# EAGLE design UI_BOARD (EAGLE 9.6.1)
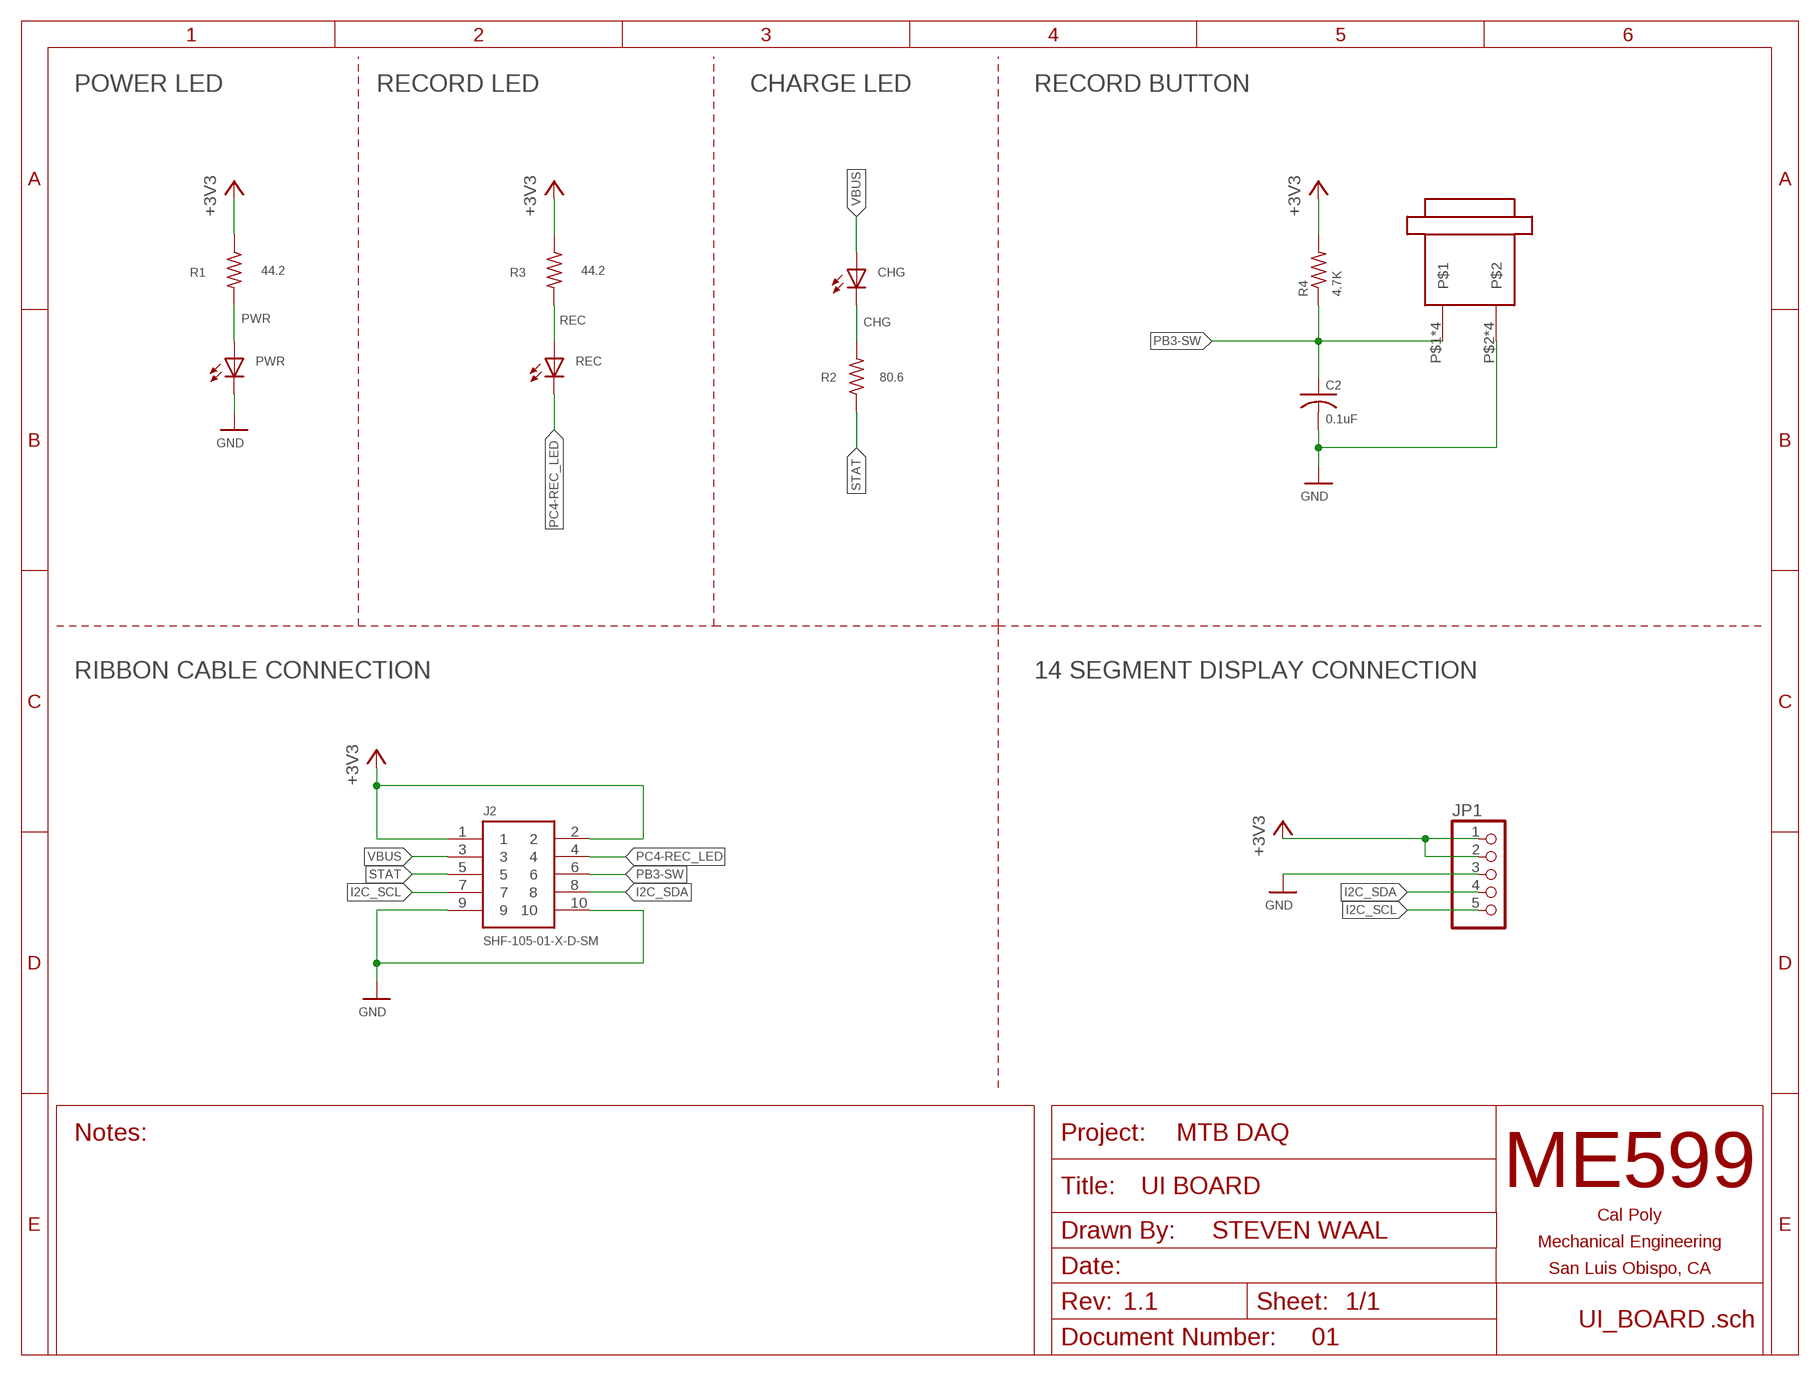
[diagram p0: schematic, sheet 1]
FRAME2 (TITLEBLOCK): AUTHOR: STEVEN WAAL; BOARD_NAME: UI BOARD; DOC_NUM: 01; PROJECT_NAME: MTB DAQ; REVISION: 1.1

## Parts
C2  0.1uF  C-USC0805  [C0805]
CHG  PANEL_MOUNT_LED  [PANEL_MOUNT_LED]
J2  SHF-105-01-X-D-SM  [SHF-105-01-X-D-SM]
JP1  PINHD-1X5  [1X05]
PWR  PANEL_MOUNT_LED  [PANEL_MOUNT_LED]
R1  44.2  R-US_R0805  [R0805]
R2  80.6  R-US_R0805  [R0805]
R3  44.2  R-US_R0805  [R0805]
R4  4.7K  R-US_R0805  [R0805]
REC  PANEL_MOUNT_LED  [PANEL_MOUNT_LED]
U$4  PANEL_MOUNT_PUSH_BUTTON  [PANEL_MOUNT_PUSH_BUTTON]

## Nets
+3V3: J2.1 J2.2 JP1.1 JP1.2 R1.1 R3.1 R4.2
CHG: CHG.P$2 R2.2
GND: C2.2 J2.9 J2.10 JP1.3 PWR.P$2 U$4.P$2 U$4.P$4 U$4.P$6 U$4.P$8
I2C_SCL: J2.7 JP1.5
I2C_SDA: J2.8 JP1.4
PB3-SW: C2.1 J2.6 R4.1 U$4.P$1 U$4.P$3 U$4.P$5 U$4.P$7
PC4-REC_LED: J2.4 REC.P$2
PWR: PWR.P$1 R1.2
REC: R3.2 REC.P$1
STAT: J2.5 R2.1
VBUS: CHG.P$1 J2.3

## Notes on the sheet
- POWER LED | RECORD LED | CHARGE LED | RECORD BUTTON
- RIBBON CABLE CONNECTION | 14 SEGMENT DISPLAY CONNECTION

## Library data of the parts
C2 = rcl:C-US: CAPACITOR, American symbol; SPICEPREFIX: C
CHG PWR REC = DigikeyLibrary:PANEL_MOUNT_LED: Digikey# 492-1573-ND
J2 = DigikeyLibrary:SHF-105-01-X-D-SM: 0.050"X0.050" SHROUDED TERMINAL STRIP ASSEMBLY, 10PINS.; AVAILABILITY: Unavailable; DESCRIPTION: Connector Header Surface Mount 10 position 0.050 _1.27mm_; MF: Samtec; MP: SHF-105-01-L-D-SM; PACKAGE: None; PRICE: None
JP1 = pinhead:PINHD-1X5: PIN HEADER
R1-R4 = rcl:R-US_: RESISTOR, American symbol; SPICEPREFIX: R
U$4 = DigikeyLibrary:PANEL_MOUNT_PUSH_BUTTON: Digikey# EG5385-ND

## Board
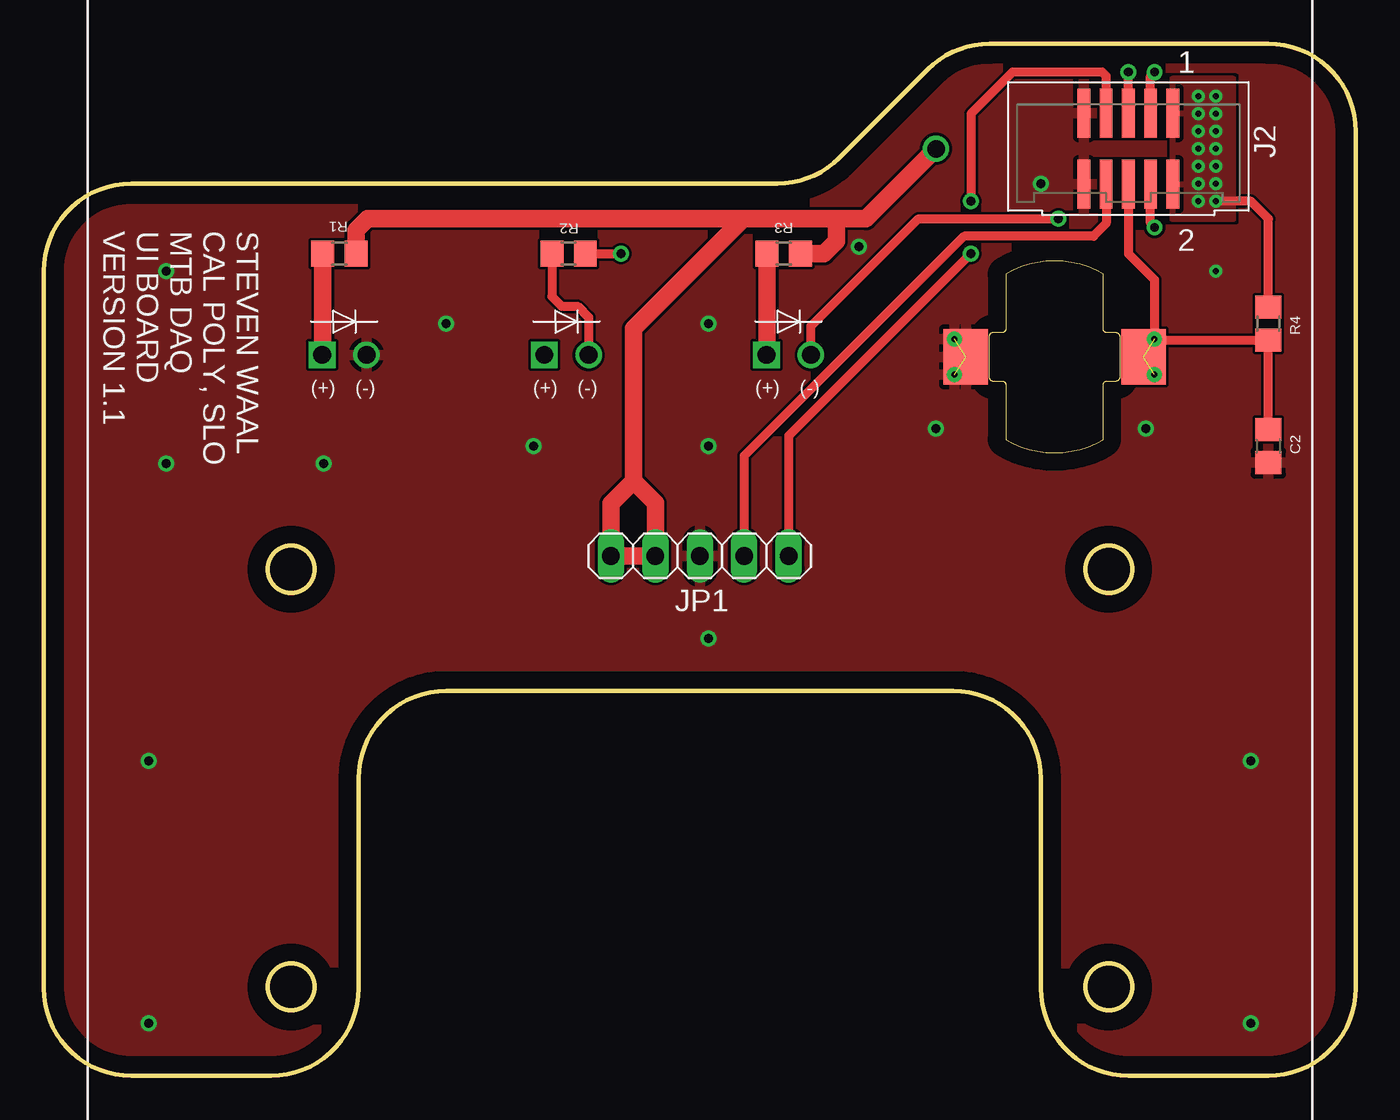
[diagram p1: board, top side]
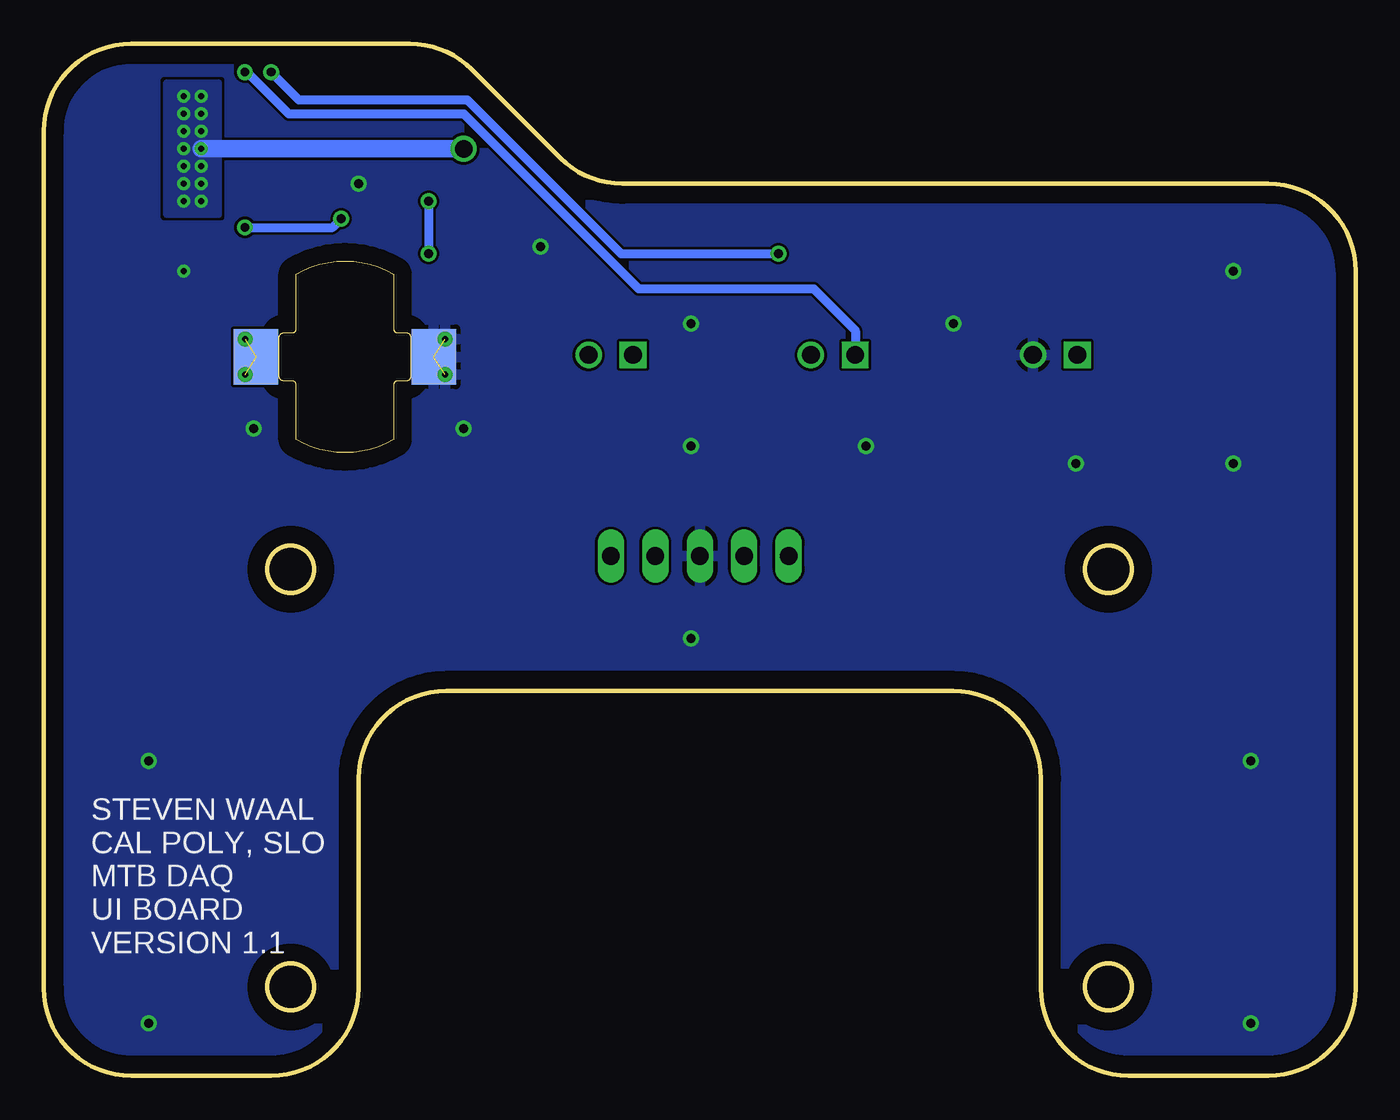
[diagram p2: board, bottom side, seen from below]

Size 75 x 59 mm. Coordinates in mm from the lower left corner, seen from the top.
Outline: 0,46 0,5 arc90 5,0 13,0 arc90 18,5 18,17 arc-90 23,22 52,22 arc-90 57,17 57,5 arc90 62,0 70,0 arc90 75,5 75,54 arc90 70,59 54.07,59 arc45 50.54,57.54 45.46,52.46 arc-45 41.93,51 5,51 arc90 0,46
Outline: circle at 14.14,5.08 radius 1.33
Outline: circle at 60.88,28.96 radius 1.33
Outline: circle at 60.88,5.08 radius 1.33
Outline: circle at 14.14,28.96 radius 1.33
Copper layers (1*16): Top 0.035mm / dielectric 1.5mm / Bottom 0.035mm
Design rules "default *": minimum track width 6mil, minimum drill 0.35mm, track to track 6mil, track to pad 6mil, pad to pad 6mil, via to via 6mil, smd to smd 6mil, copper to edge 40mil, drill to drill 6mil, minimum pad ring 10mil, minimum via ring 8mil, stop-mask expansion 4mil, vias tented up to drill 20mil, thermal gap 10mil

### Footprints (pad centres in the part's own frame; a part is rotated, then mirrored left to right if it is on the bottom)
C0805 = smd 1.3 x 1.5: 1 -0.95,0; 2 0.95,0
PANEL_MOUNT_LED = drill 1.016 square: P$1 0,0 | drill 1.016: P$2 2.54,0
SHF-105-01-X-D-SM = smd 0.737 x 2.794: 1 -2.54,-2.032; 2 -2.54,2.032; 3 -1.27,-2.032; 4 -1.27,2.032; 5 0,-2.032; 6 0,2.032; 7 1.27,-2.032; 8 1.27,2.032; 9 2.54,-2.032; 10 2.54,2.032
1X05 = drill 1.016 long: 1 -5.08,0; 2 -2.54,0; 3 0,0; 4 2.54,0; 5 5.08,0
R0805 = smd 1.3 x 1.5: 1 -0.95,0; 2 0.95,0
PANEL_MOUNT_PUSH_BUTTON = smd 2.54 x 3.175: P$1 -5.08,0; P$2 5.08,0 | smd 2.54 x 3.175 bottom: P$3 -5.08,0; P$4 5.08,0 | drill 0.35: P$5 -5.715,1.016; P$6 5.715,-1.016; P$7 -5.715,-1.016; P$8 5.715,1.016

### Placement (x,y rotation side)
C2  70,36 270 top
CHG  28.61,41.21 0 top
J2  62,53 180 top
JP1  37.5,29.72 0 top
PWR  15.91,41.21 0 top
R1  16.9,47 180 top
R2  30,47 180 top
R3  42.3,47 180 top
R4  70,43 90 top
REC  41.31,41.21 0 top
U$4  57.78,41.1 180 top

### Tracks (layer width: path | path; a pad name or v marks a point on that pad's centre or on a via)
+3V3  (via drill 0.35, 1)
  Top 0.5: R4.2 70,49 69,50 v67,50
  Top 1: R1.1 17.85,48.35 18.5,49 40,49 | 45.3,49 47,49 v51,53 | 45.3,49 40,49 | R3.1 44.6,47 45.3,47.7 45.3,49 | 33.7,34 33.7,42.7 40,49 | 33.7,34 32.42,32.72 JP1.1 JP1.2 34.96,32.74 33.7,34
  Bottom 1: v66,53 v51,53
  other vias: 66,56 67,56 66,55 67,55 66,54 67,54 67,53 66,52 67,52 66,51 67,51 66,50
  pour Top: 64.5,57 64.5,49 68,49 68,57
  pour Bottom: 65,56.8 65,49.2 68,49.2 68,56.8
CHG
  Top 0.5: R2.2 29.05,44.55 29.6,44 30.5,44 31.15,43.35 CHG.P$2
GND  (via drill 0.35, 0.5)  (2 unrouted)
  other vias: 7,46 7,35 6,18 6,3 69,3 69,18 38,25 16,35 23,43 28,36 38,36 38,43 51,37 63,37 46.6,47.4 57,51 67,46
  pour Top (rank 6): -2,-1.54 -2,60.42 76.2,60.42 76.2,-1.54
  pour Bottom (rank 6): -2,-3.54 -2,60.42 76.2,60.42 76.2,-3.54
I2C_SCL  (via drill 0.5)
  Top 0.5: J2.7 60.73,57.15 60.5,57.38 55.38,57.38 53,55 v53,50 | v53,47 42.58,36.58 JP1.5
  Bottom 0.5: v53,50 v53,47
I2C_SDA
  Top 0.5: JP1.4 40.04,35.44 52.6,48 60,48 60.73,48.73 J2.8
PB3-SW  (3 unrouted)
  Top 0.5: U$4.P$7 63.49,45.51 62,47 J2.6 | U$4.P$1 63.81,42.05 R4.1 C2.1
PC4-REC_LED  (via drill 0.5)
  Top 0.5: REC.P$2 43.85,42.85 50,49 v58,49 | v63.5,48.5 63.27,48.73 J2.4
  Bottom 0.5: v58,49 58.5,48.5 v63.5,48.5
PWR
  Top 1: R1.2 15.95,41.25 PWR.P$1
REC
  Top 1: REC.P$1 41.35,41.25 R3.2
STAT  (via drill 0.5)
  Top 0.5: R2.1 v33,47 | J2.5 v62,57.38
  Bottom 0.5: v62,57.38 60.42,55.8 50.8,55.8 42,47 v33,47
VBUS  (via drill 0.5)
  Top 0.5: J2.3 63.27,57.15 v63.5,57.38
  Bottom 0.5: v63.5,57.38 63.38,57.38 61,55 51,55 41,45 31,45 28.61,42.61 CHG.P$1

### Text on the board
tPlace: STEVEN WAAL / CAL POLY, SLO / MTB DAQ / UI BOARD / VERSION 1.1
bPlace: STEVEN WAAL / CAL POLY, SLO / MTB DAQ / UI BOARD / VERSION 1.1